# Altium schematic sheet SkyPulseUAV_Motherboard.SchDoc
size 863 x 558 mm; SheetNumber: 1; SheetTotal: 1
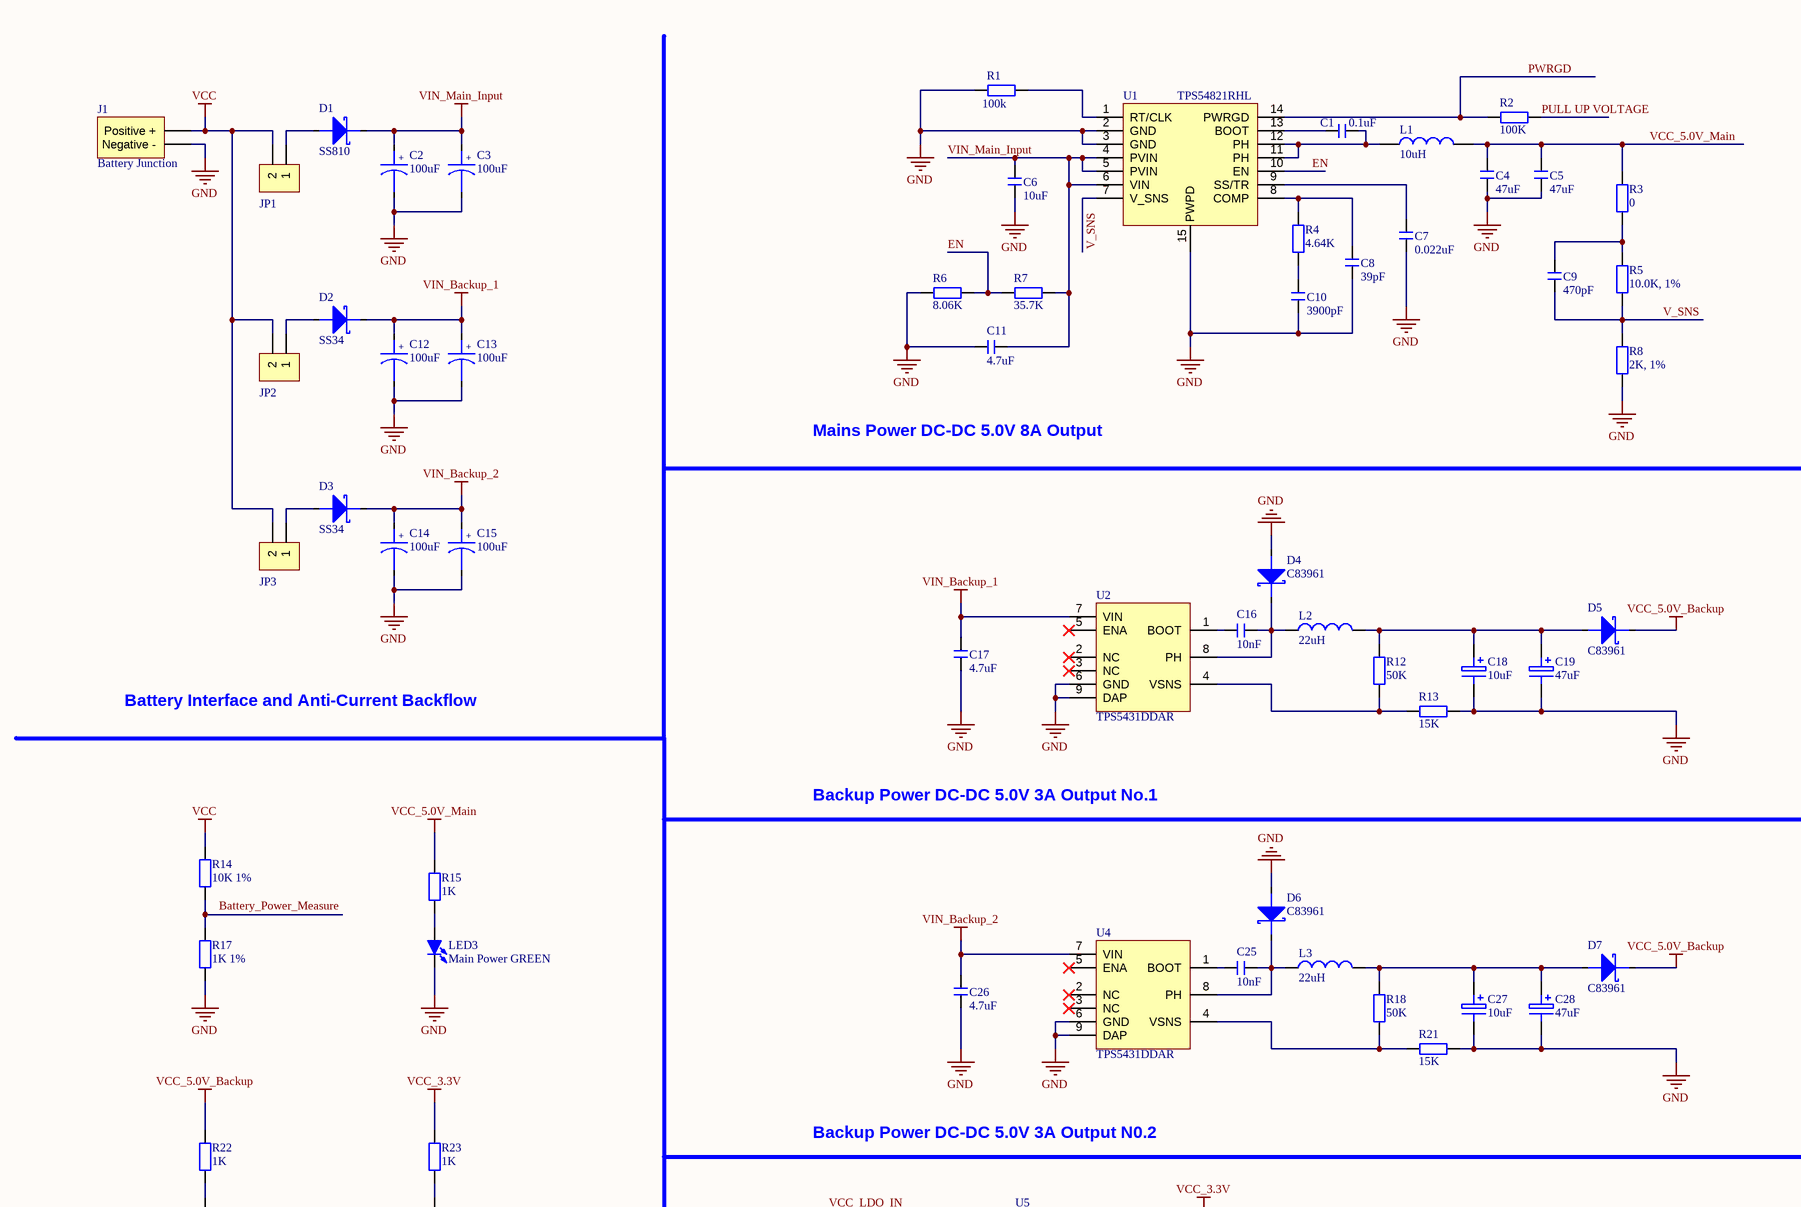
[diagram p0: SkyPulseUAV_Motherboard.SchDoc, top left]
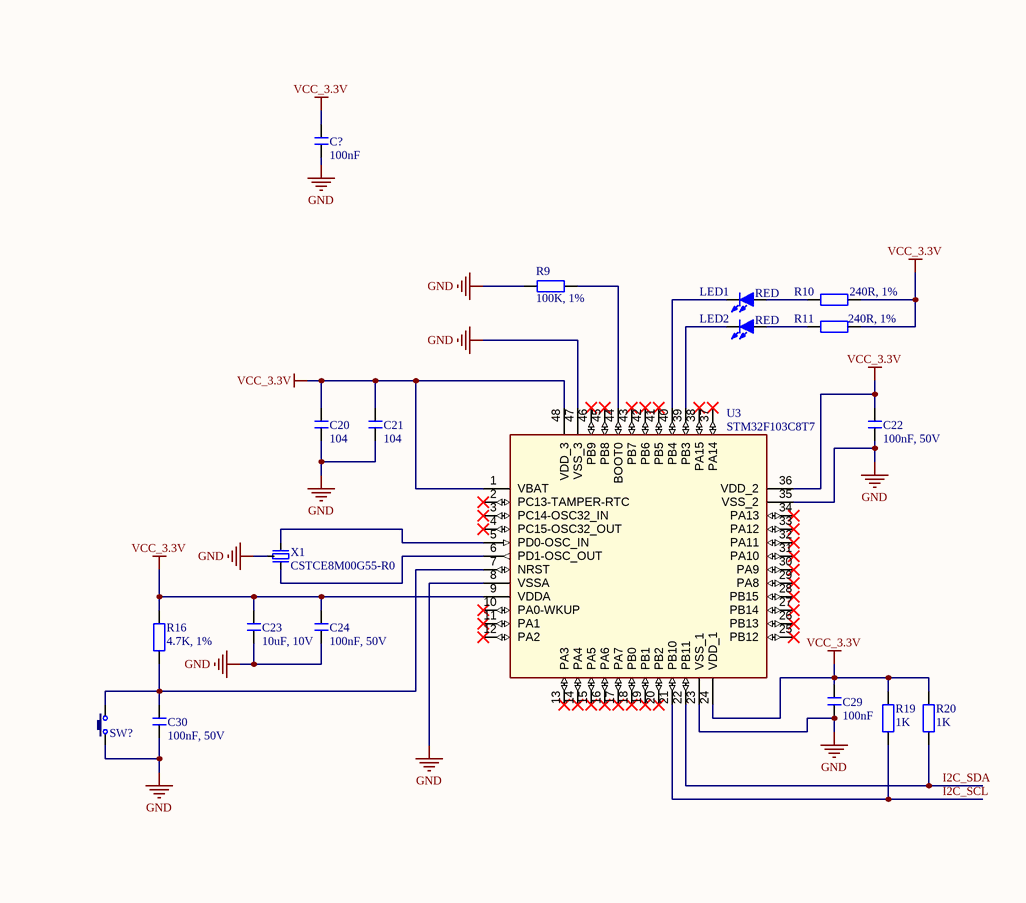
[diagram p1: SkyPulseUAV_Motherboard.SchDoc, top right]
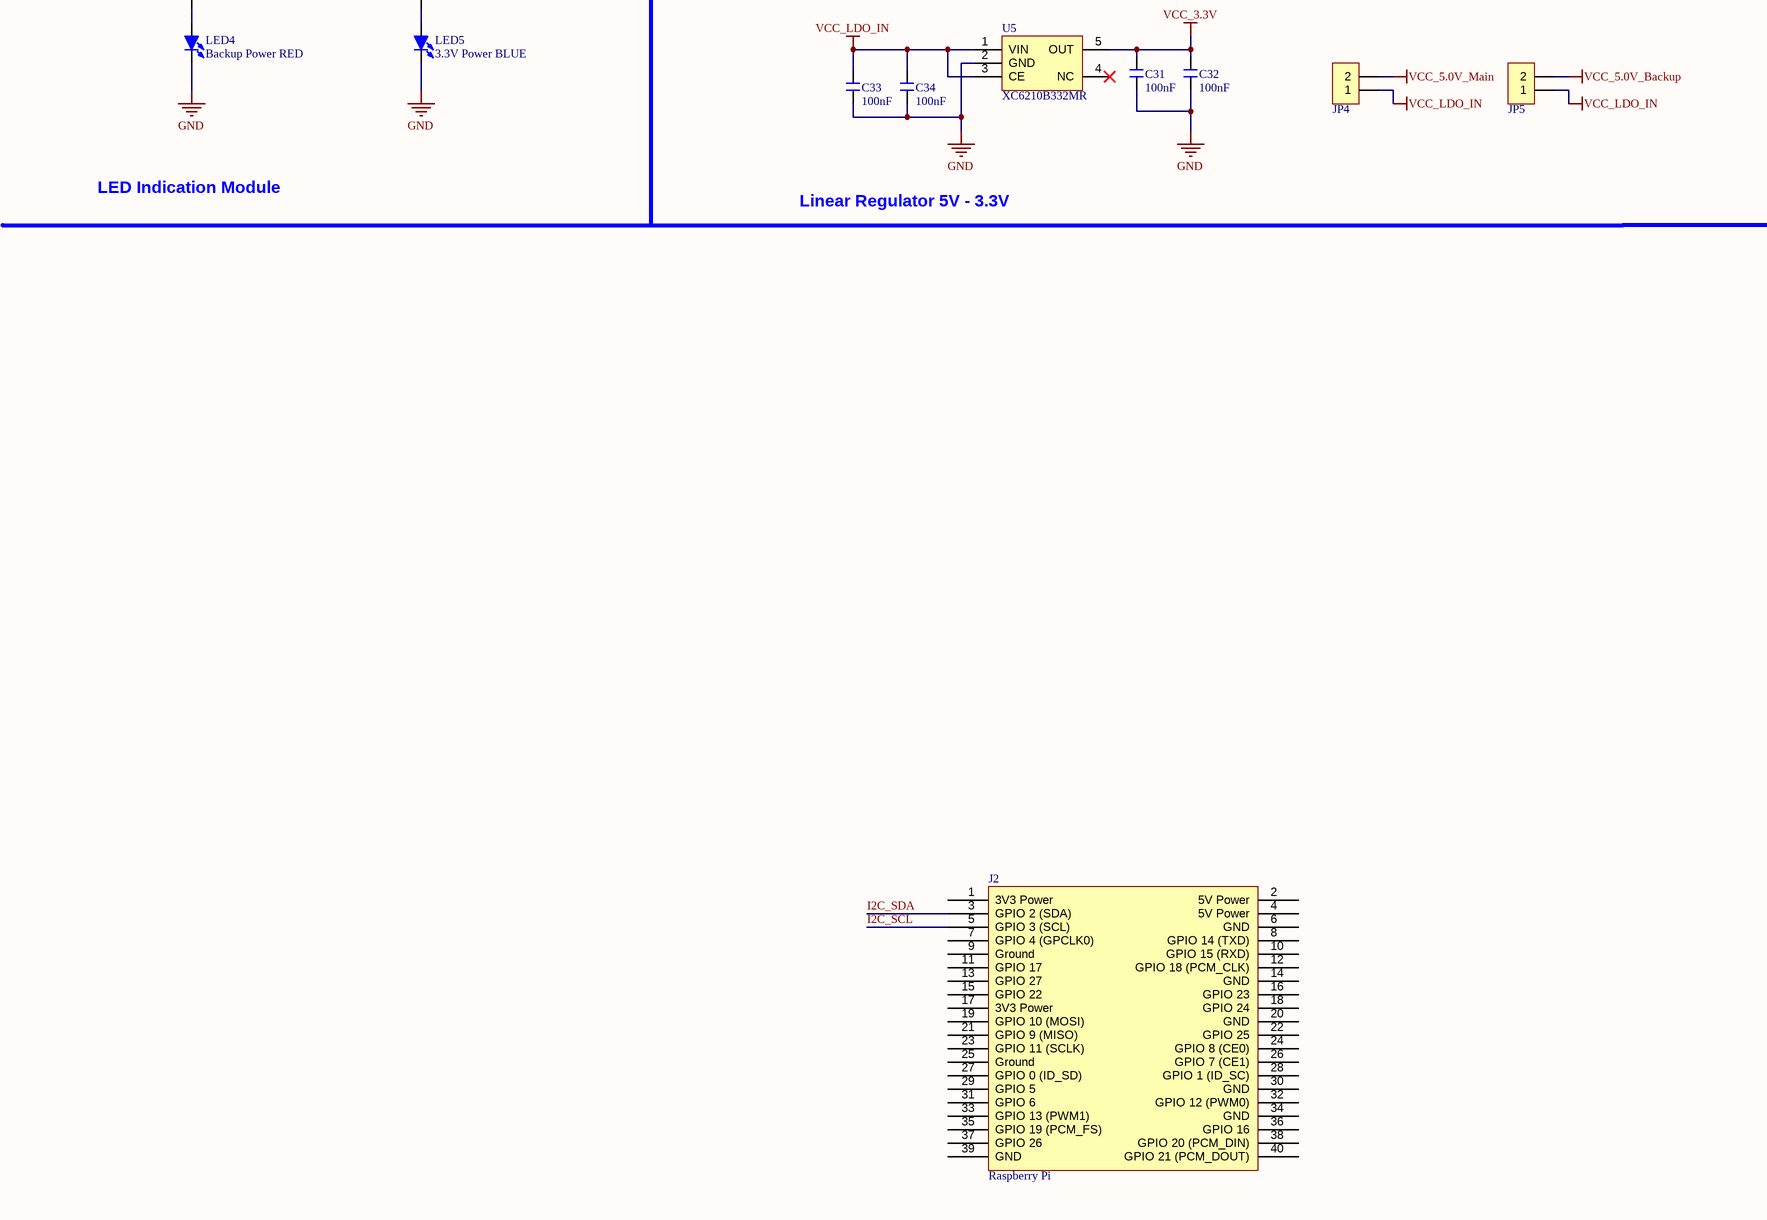
[diagram p2: SkyPulseUAV_Motherboard.SchDoc, bottom left]

## Parts
C1  0.1uF  [C 0805_M]
C2  100uF  [CM D(6.3*7.7)]
C3  100uF  [CM D(6.3*7.7)]
C4  47uF  [C 0805_M]
C5  47uF  [C 0805_M]
C6  10uF  [C 0805_M]
C7  0.022uF  [C 0805_M]
C8  39pF  [C 0805_M]
C9  470pF  [C 0805_M]
C10  3900pF  [C 0805_M]
C11  4.7uF  [C 0805_M]
C12  100uF  [CM D(6.3*7.7)]
C13  100uF  [CM D(6.3*7.7)]
C14  100uF  [CM D(6.3*7.7)]
C15  100uF  [CM D(6.3*7.7)]
C16  10nF  [C 0805_M]
C17  4.7uF  [C 0805_M]
C18  10uF  [CD B(3528)]
C19  47uF  [CD D(7343)]
C20  104  [C 0805_M]
C21  104  [C 0805_M]
C22  100nF, 50V  [C 0805_M]
C23  10uF, 10V  [C 0805_M]
C24  100nF, 50V  [C 0805_M]
C25  10nF  [C 0805_M]
C26  4.7uF  [C 0805_M]
C27  10uF  [CD B(3528)]
C28  47uF  [CD D(7343)]
C29  100nF  [C 0805_M]
C30  100nF, 50V  [C 0805_M]
C31  100nF  [C 0805_M]
C32  100nF  [C 0805_M]
C33  100nF  [C 0603_M]
C34  100nF  [C 0805_M]
C?  100nF  [C 0805_M]
D1  SS810  [SMB]
D2  SS34  [SMA]
D3  SS34  [SMA]
D4  C83961  [SMA]
D5  C83961  [SMA]
D6  C83961  [SMA]
D7  C83961  [SMA]
J1  Battery Junction
J2  Raspberry Pi
JP1  HDR-1X2  (value not drawn)
JP2  HDR-1X2  (value not drawn)
JP3  HDR-1X2  (value not drawn)
JP4  HDR-1X2  (value not drawn)
JP5  HDR-1X2  (value not drawn)
L1  10uH  [CD54]
L2  22uH  [CD54]
L3  22uH  [CD54]
LED1  RED  [LED 0805B]
LED2  RED  [LED 0805B]
LED3  Main Power GREEN  [LED 0805G]
LED4  Backup Power RED  [LED 0805R]
LED5  3.3V Power BLUE  [LED 0805B]
R1  100k  [R 0805_M]
R2  100K  [R 0805_M]
R3  0  [R 0805_M]
R4  4.64K  [R 0805_M]
R5  10.0K, 1%  [R 0805_M]
R6  8.06K  [R 0805_M]
R7  35.7K  [R 0805_M]
R8  2K, 1%  [R 0805_M]
R9  100K, 1%  [R 0805_M]
R10  240R, 1%  [R 0805_M]
R11  240R, 1%  [R 0805_M]
R12  50K  [R 0805_M]
R13  15K  [R 0805_M]
R14  10K 1%  [R 0805_M]
R15  1K  [R 0805_M]
R16  4.7K, 1%  [R 0805_M]
R17  1K 1%  [R 0805_M]
R18  50K  [R 0805_M]
R19  1K  [R 0805_M]
R20  1K  [R 0805_M]
R21  15K  [R 0805_M]
R22  1K  [R 0805_M]
R23  1K  [R 0805_M]
SW?  3x6x5  (value not drawn)
U1  TPS54821RHL
U2  TPS5431DDAR
U3  STM32F103C8T7  [TSQFP50P900X900X160-48L]
U4  TPS5431DDAR
U5  XC6210B332MR
X1  CSTCE8M00G55-R0  [CSTCE_G]

## Nets
GND: C2.2 C3.2 C4.1 C5.1 C6.1 C7.1 C8.1 C10.1 C11.1 C12.2 C13.2 C14.2 C15.2 C17.1 C18.2(E) C19.2(E) C20.1 C21.1 C22.1 C23.1 C24.1 C26.1 C27.2(E) C28.2(E) C29.2 C30.1 C31.2 C32.2 C33.1 C34.1 C?.1 D4.1 D6.1 J1.2(Negative_-) LED3.2(K) LED4.2(K) LED5.2(K) R1.1 R6.1 R8.1 R9.1 R13.1 R17.1 R21.1 SW?.2 U1.2(GND) U1.3(GND) U1.15(PWPD) U2.6(GND) U2.9(DAP) U3.8(VSSA) U3.23(VSS_1) U3.35(VSS_2) U3.47(VSS_3) U4.6(GND) U4.9(DAP) U5.2(GND) X1.2(GND)
VCC: J1.1(Positive_+) JP1.2 JP2.2 JP3.2 R14.2
VCC_3.3V: C20.2 C21.2 C22.2 C23.2 C24.2 C29.1 C31.1 C32.1 C?.2 R10.2 R11.2 R16.2 R19.2 R20.2 R23.2 U3.1(VBAT) U3.9(VDDA) U3.24(VDD_1) U3.36(VDD_2) U3.48(VDD_3) U5.5(OUT)
VCC_5.0V_Backup: D5.2 D7.2 JP5.2 R22.2
VCC_5.0V_Main: C4.2 C5.2 JP4.2 L1.2 R3.2 R15.2
VCC_LDO_IN: C33.2 C34.2 JP4.1 JP5.1 U5.1(VIN) U5.3(CE)
VIN_Backup_1: C12.1 C13.1 C17.2 D2.2 U2.7(VIN)
VIN_Backup_2: C14.1 C15.1 C26.2 D3.2 U4.7(VIN)
VIN_Main_Input: C2.1 C3.1 C6.2 C11.2 D1.2 R7.2 U1.4(PVIN) U1.5(PVIN) U1.6(VIN)
EN: R6.2 R7.1 U1.10(EN)
I2C_SCL: J2.5(GPIO_3_(SCL)) R19.1 U3.21(PB10)
I2C_SDA: J2.3(GPIO_2_(SDA)) R20.1 U3.22(PB11)
PULL UP VOLTAGE: R2.2
PWRGD: R2.1 U1.14(PWRGD)
V_SNS: C9.1 R5.1 R8.2 U1.7(V_SNS)
NetC1_1: C1.1 L1.1 U1.11(PH) U1.12(PH)
NetC1_2: C1.2 U1.13(BOOT)
NetC7_2: C7.2 U1.9(SS/TR)
NetC8_2: C8.2 R4.2 U1.8(COMP)
NetC9_2: C9.2 R3.1 R5.2
NetC10_2: C10.2 R4.1
NetC16_1: C16.1 U2.1(BOOT)
NetC16_2: C16.2 D4.2 L2.1 U2.8(PH)
NetC18_1: C18.1 C19.1 D5.1 L2.2 R12.2
NetC25_1: C25.1 U4.1(BOOT)
NetC25_2: C25.2 D6.2 L3.1 U4.8(PH)
NetC27_1: C27.1 C28.1 D7.1 L3.2 R18.2
NetC30_2: C30.2 R16.1 SW?.1 U3.7(NRST)
NetD1_1: D1.1 JP1.1
NetD2_1: D2.1 JP2.1
NetD3_1: D3.1 JP3.1
NetLED1_1: LED1.1(A) R10.1
NetLED1_2: LED1.2(K) U3.40(PB4)
NetLED2_1: LED2.1(A) R11.1
NetLED2_2: LED2.2(K) U3.39(PB3)
NetLED3_1: LED3.1(A) R15.1
NetLED4_1: LED4.1(A) R22.1
NetLED5_1: LED5.1(A) R23.1
NetR1_2: R1.2 U1.1(RT/CLK)
NetR9_2: R9.2 U3.44(BOOT0)
NetR12_1: R12.1 R13.2 U2.4(VSNS)
NetR14_1: R14.1 R17.2
NetR18_1: R18.1 R21.2 U4.4(VSNS)
NetU3_5: U3.5(PD0-OSC_IN) X1.1
NetU3_6: U3.6(PD1-OSC_OUT) X1.3

Not connected (* = marked no-connect by the designer): J2 1(3V3_Power) 2(5V_Power) 4(5V_Power) 6(GND) 7(GPIO_4_(GPCLK0)) 8(GPIO_14_(TXD)) 9(Ground) 10(GPIO_15_(RXD)) 11(GPIO_17) 12(GPIO_18_(PCM_CLK)) 13(GPIO_27) 14(GND) 15(GPIO_22) 16(GPIO_23) 17(3V3_Power) 18(GPIO_24) 19(GPIO_10_(MOSI)) 20(GND) 21(GPIO_9_(MISO)) 22(GPIO_25) 23(GPIO_11_(SCLK)) 24(GPIO_8_(CE0)) 25(Ground) 26(GPIO_7_(CE1)) 27(GPIO_0_(ID_SD)) 28(GPIO_1_(ID_SC)) 29(GPIO_5) 30(GND) 31(GPIO_6) 32(GPIO_12_(PWM0)) 33(GPIO_13_(PWM1)) 34(GND) 35(GPIO_19_(PCM_FS)) 36(GPIO_16) 37(GPIO_26) 38(GPIO_20_(PCM_DIN)) 39(GND) 40(GPIO_21_(PCM_DOUT)); U2 2(NC)* 3(NC)* 5(ENA)*; U3 2(PC13-TAMPER-RTC)* 3(PC14-OSC32_IN)* 4(PC15-OSC32_OUT)* 10(PA0-WKUP)* 11(PA1)* 12(PA2)* 13(PA3)* 14(PA4)* 15(PA5)* 16(PA6)* 17(PA7)* 18(PB0)* 19(PB1)* 20(PB2)* 25(PB12)* 26(PB13)* 27(PB14)* 28(PB15)* 29(PA8)* 30(PA9)* 31(PA10)* 32(PA11)* 33(PA12)* 34(PA13)* 37(PA14)* 38(PA15)* 41(PB5)* 42(PB6)* 43(PB7)* 45(PB8)* 46(PB9)*; U4 2(NC)* 3(NC)* 5(ENA)*; U5 4(NC)*

## Notes on the sheet
- Mains Power DC-DC 5.0V 8A Output
- Battery Interface and Anti-Current Backflow
- Backup Power DC-DC 5.0V 3A Output No.1
- Backup Power DC-DC 5.0V 3A Output N0.2
- LED Indication Module
- Linear Regulator 5V - 3.3V
- Labels drawn without touching a wire or pin: Battery_Power_Measure
- TITLE:
- SIZE
- D
- AUTHOR:
- REVISION:
- DATA:
- FILE NAME:
- SHEET
- OF
- (in symbol CAP_Electrolytic) +

## Library data of the parts
C1 C4-C11 C16 C17 C20-C26 C29-C34 C? = CAP: SMD Capacitor
C2 C3 C12-C15 = CAP_Electrolytic: SMD Aluminum Electrolytic Capacitors
C18 C27 = CAP_TAN_10uF: Tantalum capacitor, 10uF, 16V, CA45A-B-16V-10uF-K; Model: CA45A-B-16V-10uF-K
C19 C28 = CAP_TAN: Tantalum capacitor, 47uF, 16V
D1 = SS810: SURFACE MOUNT SCHOTTKY BARRIER RECTIFIER, 8A
D2-D7 = SS34: SURFACE MOUNT SCHOTTKY BARRIER RECTIFIER
J1 = Battery Junction: 7.4V, 2S1P, 38.48Wh, 80C, 5200mAh
J2 = Raspberry Pi Connector: Raspberry Pi Connector, 40P
JP1-JP5 = Header 2: 2P Jumper
L1-L3 = L: Inductance
LED1 LED2 = LED: SMD LED Red
LED3 = LED: SMD LED Green
LED4 LED5 = LED_SMD: SMD LED Red
R1-R13 R16 R18-R21 = RES: SMD Resistor
R14 R15 R17 R22 R23 = RES: SMD Resistor; BOM名称: 贴片电阻; 版权归属: 源创客; 学习资源: www.ooocke.com
SW? = TSW 3x6: Switch
U1 = TPS54821RHL: 4.5 V to 17 V Input, 8 A Synchronous Step Down Converter With Hiccup
U2 U4 = TPS5431DDAR: TPS543x 3A, Wide Input Range, Step-Down Converter
U5 = XC6210B332MR: 800mA, 25uA, Higt PSRR Voltage Regulator
X1 = CSTCE8M00G55-R0: Crystal Oscillator CSTCE8M00G55-R0